# Altium schematic sheet Sheet1.SchDoc
size A0; SheetNumber: 1; SheetTotal: 1
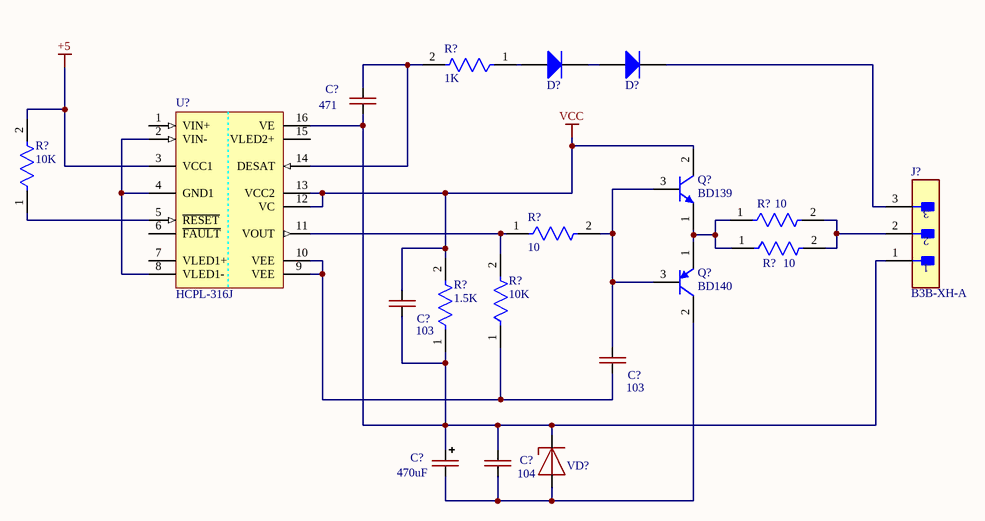
[diagram p0: Sheet1.SchDoc]

## Parts
(Parts that share a designator on the sheet are numbered #1, #2 ... from top to bottom, then left to right.)
C?#1  471  [CAP-0805]
C?#2  103  [CAP-0805]
C?#3  103  [CAP-0805]
C?#4  470uF  [CAP_SMD_Size_G]
C?#5  104  [CAP-0805]
D?#1  FR-207  [FR207]  (value not drawn)
D?#2  FR-207  [FR207]  (value not drawn)
J?  B3B-XH-A  [B3B-XH-A]
Q?#1  BD139  [TO-126(bend2)]
Q?#2  BD140  [TO-126(bend2)]
R?#1  1K  [RES-0805]
R?#2  10K  [RES-0805]
R?#3  10  [RES-1206]
R?#4  10  [RES-1206]
R?#5  10  [RES-1206]
R?#6  10K  [RES-0805]
R?#7  1.5K  [RES-2W_2]
U?  HCPL-316J  [SOIC127P1036X391-16N]
VD?  ZENER  [DO-017AA]  (value not drawn)

## Nets
+5: R?#2.2 U?.3(VCC1)
VCC: C?#2.2 Q?#1.2(C) R?#7.2 U?.12(VC) U?.13(VCC2)
NetC?#1_1: C?#1.1 C?#2.1 C?#4.1(+) C?#5.2 J?.1 R?#7.1 U?.16(VE) VD?.1(C)
NetC?#1_2: C?#1.2 R?#1.2 U?.14(DESAT)
NetC?#3_1: C?#3.1 R?#6.1 U?.9(VEE) U?.10(VEE)
NetC?#3_2: C?#3.2 Q?#1.3(B) Q?#2.3(B) R?#4.2
NetC?#4_2: C?#4.2(-) C?#5.1 Q?#2.2(C) VD?.2(A)
NetD?#1_1: D?#1.1(K) D?#2.2(A)
NetD?#1_2: D?#1.2(A) R?#1.1
NetD?#2_1: D?#2.1(K) J?.3
NetJ?_2: J?.2 R?#3.2 R?#5.2
NetQ?#1_1: Q?#1.1(E) Q?#2.1(E) R?#3.1 R?#5.1
NetR?#2_1: R?#2.1 U?.5(~{RESET})
NetR?#4_1: R?#4.1 R?#6.2 U?.11(VOUT)
NetU?_2: U?.2(VIN-) U?.4(GND1) U?.8(VLED1-)

Not connected (* = marked no-connect by the designer): U? 1(VIN+) 6(~{FAULT}) 7(VLED1+) 15(VLED2+)

## Library data of the parts
C?#1-C?#3 C?#5 = CAP-NON-POLAR
C?#4 = CAP-POLAR
D?#1 D?#2 = FR-207: FR207
Q?#1 = BD139: Plastic Medium-Power Silicon NPN Transistor, 3-Pin TO-225, Bulk Box; Manufacturer: On Semiconductor; IC Continuous (A): 1.5; Packing: Bulk Box; ComponentLink2URL: http://www.onsemi.com/pub_link/Collateral/BD135-D.PDF; ComponentLink2Description: Datasheet; ComponentLink1URL: http://www.onsemi.com/; Polarity: NPN; PartNumber: BD139; ComponentLink1Description: Manufacturer URL; RoHS: FALSE; ComponentLink3Description: Package Specification; PackageReference: TO-225-3-77-09; Mounting Technology: Through Hole; DatasheetVersion: Rev. 16; PackageDescription: 3-Pin Flange Mount, Vertical Straight Lead, Body 7.6 x 2.7 mm, Pitch 2.29 mm; PackageVersion: Rev. AC, 12/2013; ComponentLink3URL: http://www.onsemi.com/pub_link/Collateral/77-09.PDF
Q?#2 = BD140: Plastic Medium-Power Silicon PNP Transistor, 3-Pin TO-225, Bulk Box; Manufacturer: On Semiconductor; IC Continuous (A): 1.5; PartNumber: BD140; ComponentLink1Description: Manufacturer URL; RoHS: FALSE; ComponentLink1URL: http://www.onsemi.com/; DatasheetVersion: Rev. 15; ComponentLink2URL: http://www.onsemi.com/pub_link/Collateral/BD136-D.PDF; ComponentLink3Description: Package Specification; Packing: Bulk Box; PackageVersion: Rev. AC, 12/2013; ComponentLink3URL: http://www.onsemi.com/pub_link/Collateral/77-09.PDF; PackageDescription: 3-Pin Flange Mount, Vertical Straight Lead, Body 7.6 x 2.7 mm, Pitch 2.29 mm; Mounting Technology: Through Hole; PackageReference: TO-225-3-77-09; ComponentLink2Description: Datasheet; Polarity: PNP
R?#1-R?#7 = RES-CONST